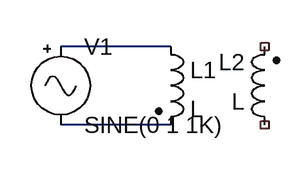
[diagram p0: schematic Transformer Circuit.asc]
Transformer Circuit.asc, the LTspice schematic file:
Version 4
SHEET 1 880 680
WIRE 0 128 -112 128
WIRE 0 208 -112 208
SYMBOL ind2 -16 112 R0
SYMATTR InstName L1
SYMBOL ind2 112 224 R180
WINDOW 0 36 80 Left 2
WINDOW 3 36 40 Left 2
SYMATTR InstName L2
SYMBOL Misc\\signal -112 112 R0
SYMATTR InstName V1

The netlist it stands for:
* Transformer Circuit.asc
L1 N001 N002 L
L2 NC_01 NC_02 L
V1 N001 N002 SINE(0 1 1K)
.backanno
.end